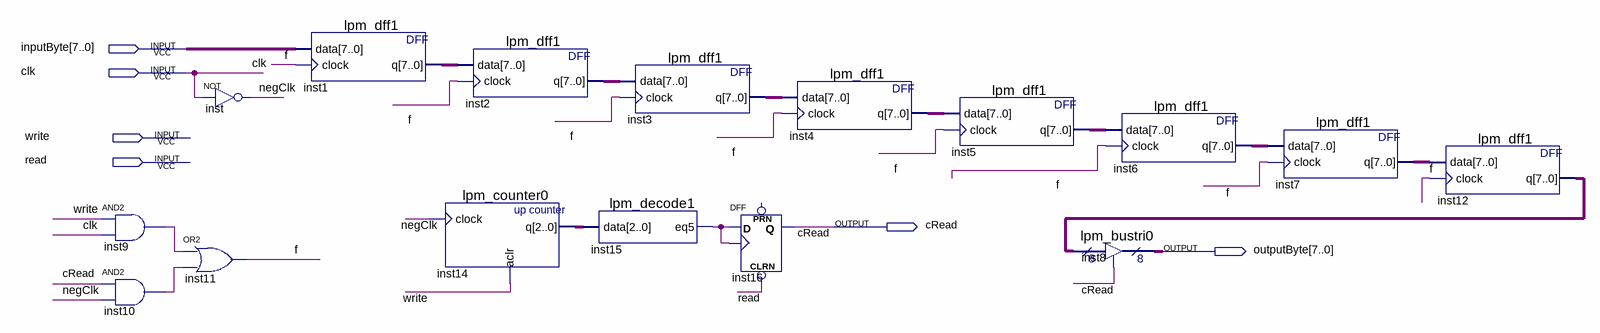
[diagram p0: schematic sheet]
// Quartus schematic AltBuffer.bdf as structural Verilog: 16 symbols, 6 pins
module AltBuffer (
  input  [7:0] inputByte,
  input  clk,
  input  write,
  input  read,
  output cRead,
  output [7:0] outputByte
);

  wire f, inst9_out, inst10_out, inst15_eq5, negClk;
  wire [2:0] inst14_q;
  wire [7:0] inst1_q, inst2_q, inst3_q, inst4_q, inst5_q, inst6_q, inst7_q, inst12_q;

  and inst9 (inst9_out, write, clk);
  and inst10 (inst10_out, cRead, negClk);
  or inst11 (f, inst9_out, inst10_out);
  not inst (negClk, clk);
  lpm_dff1 inst1 (.data(inputByte), .clock(f), .q(inst1_q));
  lpm_counter0 inst14 (.clock(negClk), .aclr(write), .q(inst14_q));
  lpm_dff1 inst2 (.data(inst1_q), .clock(f), .q(inst2_q));
  lpm_decode1 inst15 (.data(inst14_q), .eq5(inst15_eq5));
  lpm_dff1 inst3 (.data(inst2_q), .clock(f), .q(inst3_q));
  DFF inst16 (.CLRN(read), .CLK(inst15_eq5), .D(inst15_eq5), .Q(cRead));  // open: PRN
  lpm_dff1 inst4 (.data(inst3_q), .clock(f), .q(inst4_q));
  lpm_dff1 inst5 (.data(inst4_q), .clock(f), .q(inst5_q));
  lpm_bustri0 inst8 (.enabledt(cRead), .data(inst12_q), .tridata(outputByte));
  lpm_dff1 inst6 (.data(inst5_q), .clock(f), .q(inst6_q));
  lpm_dff1 inst7 (.data(inst6_q), .clock(f), .q(inst7_q));
  lpm_dff1 inst12 (.data(inst7_q), .clock(f), .q(inst12_q));
endmodule
